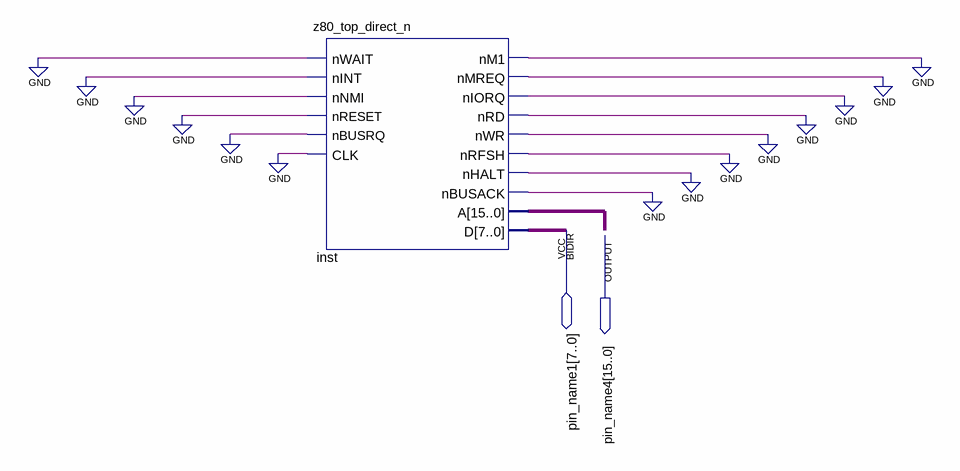
[diagram p0: schematic sheet]
// Quartus schematic cpu_top.bdf as structural Verilog: 1 symbols, 2 pins
module cpu_top (
  inout  [7:0] pin_name1,
  output [15:0] pin_name4
);

  wire inst_nbusack, inst_nhalt, inst_niorq, inst_nm1, inst_nmreq, inst_nrd, inst_nrfsh, inst_nwr;

  z80_top_direct_n inst (
    .nWAIT(1'b0), .nINT(1'b0), .nNMI(1'b0), .nRESET(1'b0), .nBUSRQ(1'b0), .CLK(1'b0), .nM1(inst_nm1),
    .nMREQ(inst_nmreq), .nIORQ(inst_niorq), .nRD(inst_nrd), .nWR(inst_nwr), .nRFSH(inst_nrfsh),
    .nHALT(inst_nhalt), .nBUSACK(inst_nbusack), .A(pin_name4), .D(pin_name1));
  // also tied to GND on the sheet: {inst_nm1, inst_nmreq, inst_niorq, inst_nrd, inst_nrfsh, inst_nwr, inst_nhalt, inst_nbusack}
endmodule
